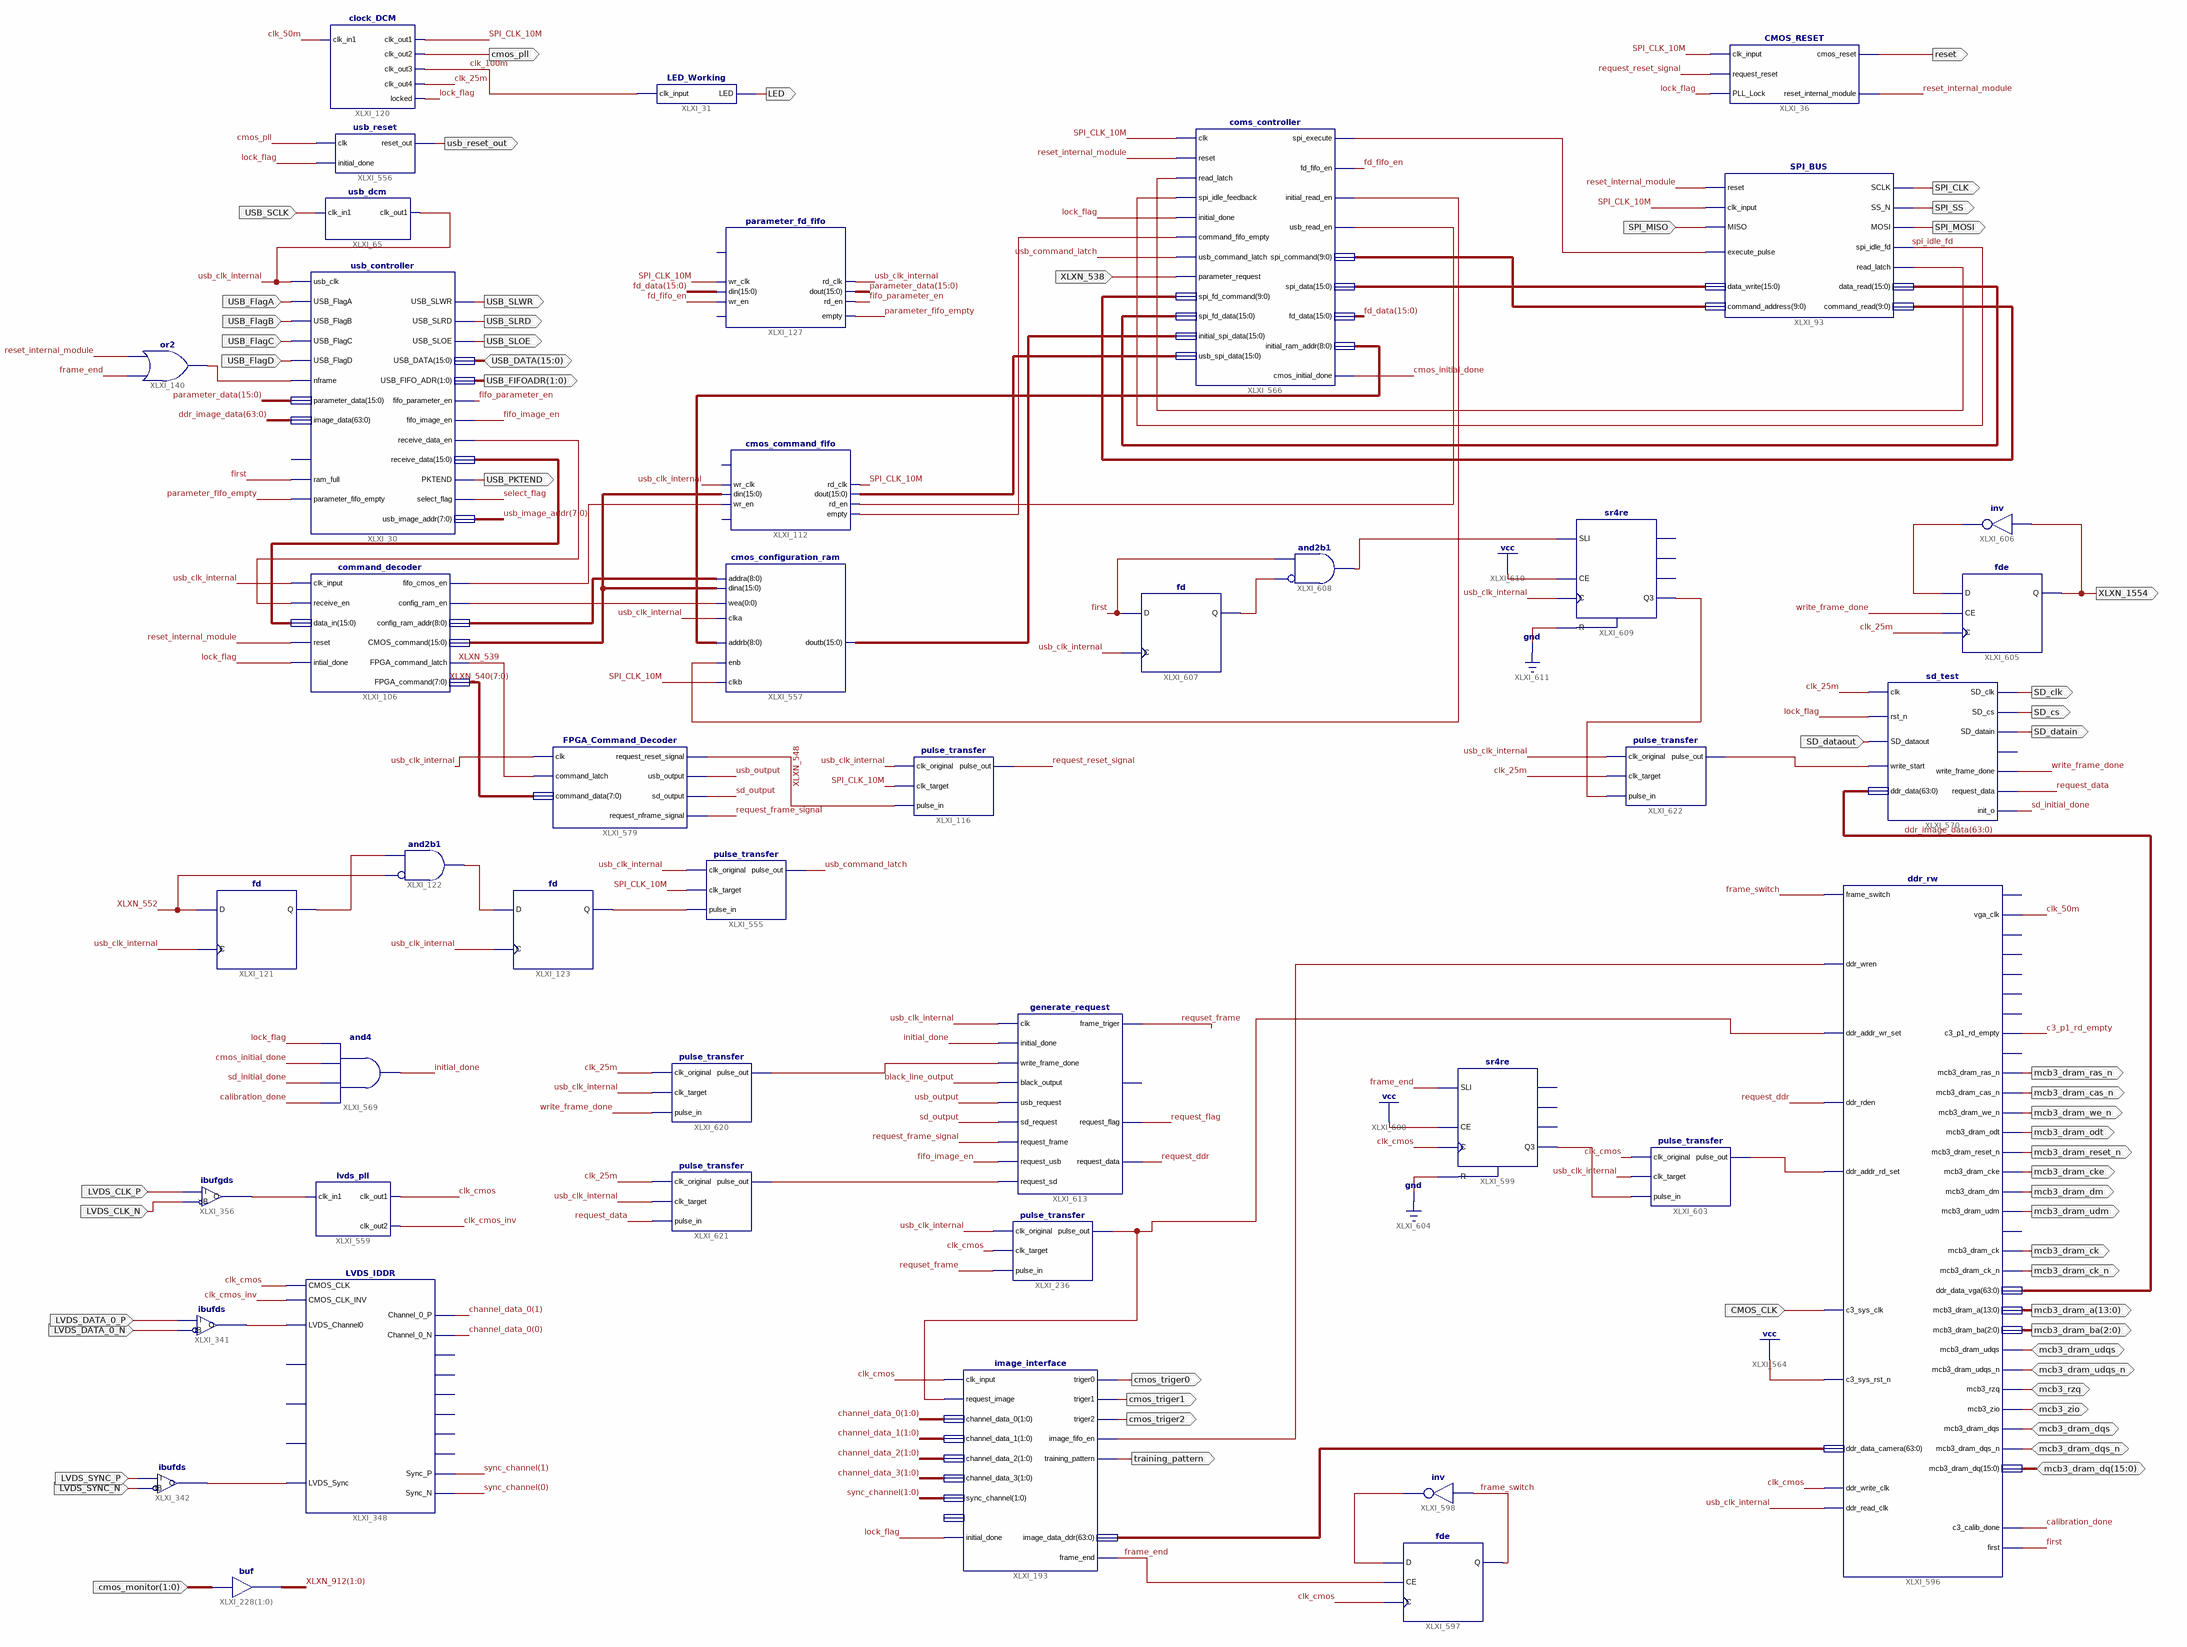
[diagram p0: schematic sheet 1]
// Xilinx ISE schematic main.sch (spartan6) as structural Verilog: 43 symbols, 56 ports
module main (
  input  USB_FlagD,
  input  USB_FlagC,
  input  USB_FlagB,
  input  USB_FlagA,
  input  USB_SCLK,
  input  CMOS_CLK,
  input  SPI_MISO,
  input  XLXN_538,
  input  SD_dataout,
  input  [1:0] cmos_monitor,
  input  LVDS_SYNC_N,
  input  LVDS_SYNC_P,
  input  LVDS_DATA_0_N,
  input  LVDS_DATA_0_P,
  input  LVDS_CLK_P,
  input  LVDS_CLK_N,
  inout  [15:0] USB_DATA,
  inout  [15:0] mcb3_dram_dq,
  inout  mcb3_dram_dqs,
  inout  mcb3_dram_dqs_n,
  inout  mcb3_dram_udqs,
  inout  mcb3_dram_udqs_n,
  inout  mcb3_rzq,
  inout  mcb3_zio,
  output USB_SLWR,
  output USB_SLRD,
  output USB_SLOE,
  output [1:0] USB_FIFOADR,
  output USB_PKTEND,
  output reset,
  output SPI_CLK,
  output SPI_SS,
  output SPI_MOSI,
  output LED,
  output cmos_pll,
  output usb_reset_out,
  output [13:0] mcb3_dram_a,
  output [2:0] mcb3_dram_ba,
  output mcb3_dram_cas_n,
  output mcb3_dram_ck,
  output mcb3_dram_ck_n,
  output mcb3_dram_cke,
  output mcb3_dram_dm,
  output mcb3_dram_odt,
  output mcb3_dram_ras_n,
  output mcb3_dram_reset_n,
  output mcb3_dram_udm,
  output mcb3_dram_we_n,
  output cmos_triger0,
  output cmos_triger1,
  output cmos_triger2,
  output training_pattern,
  output SD_clk,
  output SD_cs,
  output SD_datain,
  output XLXN_1554
);

  wire black_line_output, c3_p1_rd_empty, calibration_done, clk_25m, clk_50m, clk_100m, clk_cmos,
       clk_cmos_inv, cmos_initial_done, fd_fifo_en, fifo_image_en, fifo_parameter_en, first, frame_end,
       frame_switch, initial_done, lock_flag, parameter_fifo_empty, request_data, request_ddr, request_flag,
       request_frame_signal, request_reset_signal, requset_frame, reset_internal_module, sd_initial_done,
       sd_output, select_flag, SPI_CLK_10M, spi_idle_fd, usb_clk_internal, usb_command_latch, usb_output,
       write_frame_done, XLXN_423, XLXN_471, XLXN_519, XLXN_520, XLXN_521, XLXN_539, XLXN_548, XLXN_551,
       XLXN_552, XLXN_553, XLXN_555, XLXN_572, XLXN_610, XLXN_1246, XLXN_1248, XLXN_1249, XLXN_1400,
       XLXN_1535, XLXN_1543, XLXN_1550, XLXN_1552, XLXN_1557, XLXN_1570, XLXN_1586, XLXN_1594, XLXN_1598,
       XLXN_1599, XLXN_1607;
  wire [0:0] XLXN_506;
  wire [1:0] channel_data_0, channel_data_1, channel_data_2, channel_data_3, sync_channel, XLXN_912;
  wire [7:0] usb_image_addr, XLXN_540;
  wire [8:0] XLXN_504, XLXN_518;
  wire [9:0] XLXN_422, XLXN_570;
  wire [15:0] fd_data, parameter_data, XLXN_421, XLXN_473, XLXN_505, XLXN_513, XLXN_524, XLXN_567;
  wire [63:0] ddr_image_data, XLXN_1399;

  usb_dcm XLXI_65 (.clk_in1(USB_SCLK), .clk_out1(usb_clk_internal));
  CMOS_RESET XLXI_36 (
    .clk_input(SPI_CLK_10M), .request_reset(request_reset_signal), .PLL_Lock(lock_flag),
    .reset_internal_module(reset_internal_module), .cmos_reset(reset));
  SPI_BUS XLXI_93 (
    .reset(reset_internal_module), .clk_input(SPI_CLK_10M), .SCLK(SPI_CLK), .SS_N(SPI_SS), .MISO(SPI_MISO),
    .spi_idle_fd(spi_idle_fd), .MOSI(SPI_MOSI), .execute_pulse(XLXN_423), .read_latch(XLXN_572),
    .data_write(XLXN_421), .command_address(XLXN_422), .data_read(XLXN_567), .command_read(XLXN_570));
  command_decoder XLXI_106 (
    .clk_input(usb_clk_internal), .reset(reset_internal_module), .intial_done(lock_flag),
    .receive_en(XLXN_471), .data_in(XLXN_473), .fifo_cmos_en(XLXN_552), .config_ram_en(XLXN_506[0]),
    .CMOS_command(XLXN_505), .config_ram_addr(XLXN_504), .FPGA_command_latch(XLXN_539),
    .FPGA_command(XLXN_540));
  cmos_command_fifo XLXI_112 (
    .wr_clk(usb_clk_internal), .din(XLXN_505), .wr_en(XLXN_552), .rd_clk(SPI_CLK_10M), .dout(XLXN_524),
    .rd_en(XLXN_520), .empty(XLXN_521));  // open: rst, full
  pulse_transfer XLXI_116 (
    .clk_original(usb_clk_internal), .clk_target(SPI_CLK_10M), .pulse_in(XLXN_548),
    .pulse_out(request_reset_signal));
  parameter_fd_fifo XLXI_127 (
    .wr_clk(SPI_CLK_10M), .din(fd_data), .wr_en(fd_fifo_en), .rd_clk(usb_clk_internal),
    .dout(parameter_data), .rd_en(fifo_parameter_en), .empty(parameter_fifo_empty));  // open: rst, full
  or XLXI_140 (XLXN_610, frame_end, reset_internal_module);
  LED_Working XLXI_31 (.clk_input(clk_100m), .LED(LED));
  fd XLXI_121 (.C(usb_clk_internal), .D(XLXN_552), .Q(XLXN_551));
  and XLXI_122 (XLXN_553, ~XLXN_552, XLXN_551);  // and2b1
  fd XLXI_123 (.C(usb_clk_internal), .D(XLXN_553), .Q(XLXN_555));
  pulse_transfer XLXI_555 (
    .clk_original(usb_clk_internal), .clk_target(SPI_CLK_10M), .pulse_in(XLXN_555),
    .pulse_out(usb_command_latch));
  usb_reset XLXI_556 (.clk(cmos_pll), .initial_done(lock_flag), .reset_out(usb_reset_out));
  cmos_configuration_ram XLXI_557 (
    .addra(XLXN_504), .dina(XLXN_505), .wea(XLXN_506[0]), .addrb(XLXN_518), .enb(XLXN_519),
    .clka(usb_clk_internal), .doutb(XLXN_513), .clkb(SPI_CLK_10M));
  clock_DCM XLXI_120 (
    .clk_in1(clk_50m), .clk_out1(SPI_CLK_10M), .clk_out2(cmos_pll), .clk_out3(clk_100m), .clk_out4(clk_25m),
    .locked(lock_flag));
  coms_controller XLXI_566 (
    .clk(SPI_CLK_10M), .reset(reset_internal_module), .read_latch(XLXN_572), .spi_idle_feedback(spi_idle_fd),
    .initial_done(lock_flag), .command_fifo_empty(XLXN_521), .usb_command_latch(usb_command_latch),
    .parameter_request(XLXN_538), .spi_fd_command(XLXN_570), .spi_fd_data(XLXN_567),
    .initial_spi_data(XLXN_513), .usb_spi_data(XLXN_524), .spi_execute(XLXN_423), .fd_fifo_en(fd_fifo_en),
    .initial_read_en(XLXN_519), .usb_read_en(XLXN_520), .spi_command(XLXN_422), .spi_data(XLXN_421),
    .fd_data(fd_data), .initial_ram_addr(XLXN_518), .cmos_initial_done(cmos_initial_done));
  sd_test XLXI_570 (
    .clk(clk_25m), .rst_n(lock_flag), .SD_dataout(SD_dataout), .write_start(XLXN_1598),
    .ddr_data(ddr_image_data), .SD_clk(SD_clk), .SD_cs(SD_cs), .SD_datain(SD_datain),
    .write_frame_done(write_frame_done), .request_data(request_data), .init_o(sd_initial_done));  // open: led_out
  assign XLXN_912 = cmos_monitor;  // buf XLXI_228[1..0], 2 bits wide
  FPGA_Command_Decoder XLXI_579 (
    .clk(usb_clk_internal), .command_latch(XLXN_539), .command_data(XLXN_540),
    .request_reset_signal(XLXN_548), .request_nframe_signal(request_frame_signal), .usb_output(usb_output),
    .sd_output(sd_output));
  LVDS_IDDR XLXI_348 (
    .LVDS_Channel0(XLXN_1249), .Channel_0_P(channel_data_0[1]), .Channel_0_N(channel_data_0[0]),
    .Sync_P(sync_channel[1]), .Sync_N(sync_channel[0]), .LVDS_Sync(XLXN_1248), .CMOS_CLK_INV(clk_cmos_inv),
    .CMOS_CLK(clk_cmos));  // open: Channel_1_P, Channel_1_N, Channel_2_P, Channel_2_N, Channel_3_P, Channel_3_N, LVDS_Channel1, LVDS_Channel3, LVDS_Channel2
  ibufds #(.DIFF_TERM("TRUE")) XLXI_342 (.I(LVDS_SYNC_P), .IB(LVDS_SYNC_N), .O(XLXN_1248));
  ibufds #(.DIFF_TERM("TRUE")) XLXI_341 (.I(LVDS_DATA_0_P), .IB(LVDS_DATA_0_N), .O(XLXN_1249));
  ibufgds #(.DIFF_TERM("TRUE")) XLXI_356 (.I(LVDS_CLK_P), .IB(LVDS_CLK_N), .O(XLXN_1246));
  lvds_pll XLXI_559 (.clk_in1(XLXN_1246), .clk_out1(clk_cmos), .clk_out2(clk_cmos_inv));
  and XLXI_569 (initial_done, calibration_done, sd_initial_done, cmos_initial_done, lock_flag);
  pulse_transfer XLXI_236 (
    .clk_original(usb_clk_internal), .clk_target(clk_cmos), .pulse_in(requset_frame), .pulse_out(XLXN_1607));
  image_interface XLXI_193 (
    .clk_input(clk_cmos), .request_image(XLXN_1607), .initial_done(lock_flag),
    .channel_data_0(channel_data_0), .channel_data_1(channel_data_1), .channel_data_2(channel_data_2),
    .channel_data_3(channel_data_3), .sync_channel(sync_channel), .triger0(cmos_triger0),
    .triger1(cmos_triger1), .triger2(cmos_triger2), .image_fifo_en(XLXN_1400),
    .training_pattern(training_pattern), .image_data_ddr(XLXN_1399), .frame_end(frame_end));  // open: monitor
  ddr_rw XLXI_596 (
    .ddr_write_clk(clk_cmos), .ddr_read_clk(usb_clk_internal), .frame_switch(frame_switch),
    .ddr_wren(XLXN_1400), .ddr_addr_wr_set(XLXN_1607), .ddr_rden(request_ddr), .ddr_addr_rd_set(XLXN_1550),
    .c3_sys_clk(CMOS_CLK), .c3_sys_rst_n(1'b1), .ddr_data_camera(XLXN_1399), .mcb3_dram_udqs(mcb3_dram_udqs),
    .mcb3_dram_udqs_n(mcb3_dram_udqs_n), .mcb3_rzq(mcb3_rzq), .mcb3_zio(mcb3_zio),
    .mcb3_dram_dqs(mcb3_dram_dqs), .mcb3_dram_dqs_n(mcb3_dram_dqs_n), .mcb3_dram_dq(mcb3_dram_dq),
    .vga_clk(clk_50m), .c3_calib_done(calibration_done), .c3_p1_rd_empty(c3_p1_rd_empty),
    .mcb3_dram_ras_n(mcb3_dram_ras_n), .mcb3_dram_cas_n(mcb3_dram_cas_n), .mcb3_dram_we_n(mcb3_dram_we_n),
    .mcb3_dram_odt(mcb3_dram_odt), .mcb3_dram_reset_n(mcb3_dram_reset_n), .mcb3_dram_cke(mcb3_dram_cke),
    .mcb3_dram_dm(mcb3_dram_dm), .mcb3_dram_udm(mcb3_dram_udm), .mcb3_dram_ck(mcb3_dram_ck),
    .mcb3_dram_ck_n(mcb3_dram_ck_n), .ddr_data_vga(ddr_image_data), .mcb3_dram_a(mcb3_dram_a),
    .mcb3_dram_ba(mcb3_dram_ba), .first(first));  // open: camera_clk, c3_clk0, c3_p0_wr_underrun, c3_p0_wr_full, c3_p0_cmd_full, c3_p1_rd_overflow, c3_p1_cmd_full, c3_rst0
  fde XLXI_597 (.C(clk_cmos), .CE(frame_end), .D(XLXN_1535), .Q(frame_switch));
  not XLXI_598 (XLXN_1535, frame_switch);
  sr4re XLXI_599 (.C(clk_cmos), .CE(1'b1), .R(1'b0), .SLI(frame_end), .Q3(XLXN_1543));  // open: Q0, Q1, Q2
  pulse_transfer XLXI_603 (
    .clk_original(clk_cmos), .clk_target(usb_clk_internal), .pulse_in(XLXN_1543), .pulse_out(XLXN_1550));
  fd XLXI_607 (.C(usb_clk_internal), .D(first), .Q(XLXN_1557));
  and XLXI_608 (XLXN_1570, ~XLXN_1557, first);  // and2b1
  sr4re XLXI_609 (.C(usb_clk_internal), .CE(1'b1), .R(1'b0), .SLI(XLXN_1570), .Q3(XLXN_1599));  // open: Q0, Q1, Q2
  fde XLXI_605 (.C(clk_25m), .CE(write_frame_done), .D(XLXN_1552), .Q(XLXN_1554));
  not XLXI_606 (XLXN_1552, XLXN_1554);
  generate_request XLXI_613 (
    .clk(usb_clk_internal), .initial_done(initial_done), .write_frame_done(XLXN_1586),
    .black_output(black_line_output), .usb_request(usb_output), .sd_request(sd_output),
    .request_frame(request_frame_signal), .request_usb(fifo_image_en), .request_sd(XLXN_1594),
    .frame_triger(requset_frame), .request_data(request_ddr), .request_flag(request_flag));  // open: write_start
  usb_controller XLXI_30 (
    .usb_clk(usb_clk_internal), .USB_FlagA(USB_FlagA), .USB_FlagB(USB_FlagB), .USB_FlagC(USB_FlagC),
    .USB_FlagD(USB_FlagD), .nframe(XLXN_610), .parameter_fifo_empty(parameter_fifo_empty), .ram_full(first),
    .parameter_data(parameter_data), .image_data(ddr_image_data), .USB_DATA(USB_DATA), .PKTEND(USB_PKTEND),
    .USB_SLWR(USB_SLWR), .USB_SLRD(USB_SLRD), .USB_SLOE(USB_SLOE), .fifo_parameter_en(fifo_parameter_en),
    .receive_data_en(XLXN_471), .fifo_image_en(fifo_image_en), .select_flag(select_flag),
    .USB_FIFO_ADR(USB_FIFOADR), .receive_data(XLXN_473), .usb_image_addr(usb_image_addr));  // open: send_out
  pulse_transfer XLXI_620 (
    .clk_original(clk_25m), .clk_target(usb_clk_internal), .pulse_in(write_frame_done), .pulse_out(XLXN_1586));
  pulse_transfer XLXI_621 (
    .clk_original(clk_25m), .clk_target(usb_clk_internal), .pulse_in(request_data), .pulse_out(XLXN_1594));
  pulse_transfer XLXI_622 (
    .clk_original(usb_clk_internal), .clk_target(clk_25m), .pulse_in(XLXN_1599), .pulse_out(XLXN_1598));
endmodule
